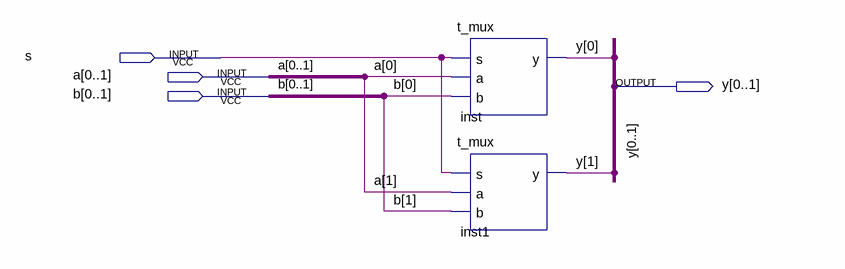
[diagram p0: schematic sheet]
// Quartus schematic t_2mux_m.bdf as structural Verilog: 2 symbols, 4 pins
module t_2mux_m (
  input  s,
  input  [0:1] a,
  input  [0:1] b,
  output [0:1] y
);

  t_mux inst (.s(s), .a(a[0]), .b(b[0]), .y(y[0]));
  t_mux inst1 (.s(s), .a(a[1]), .b(b[1]), .y(y[1]));
endmodule
